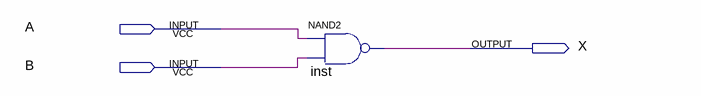
[diagram p0: schematic sheet]
// Quartus schematic nand2sim.bdf as structural Verilog: 1 symbols, 3 pins
module nand2sim (
  input  A,
  input  B,
  output X
);

  nand inst (X, A, B);
endmodule
